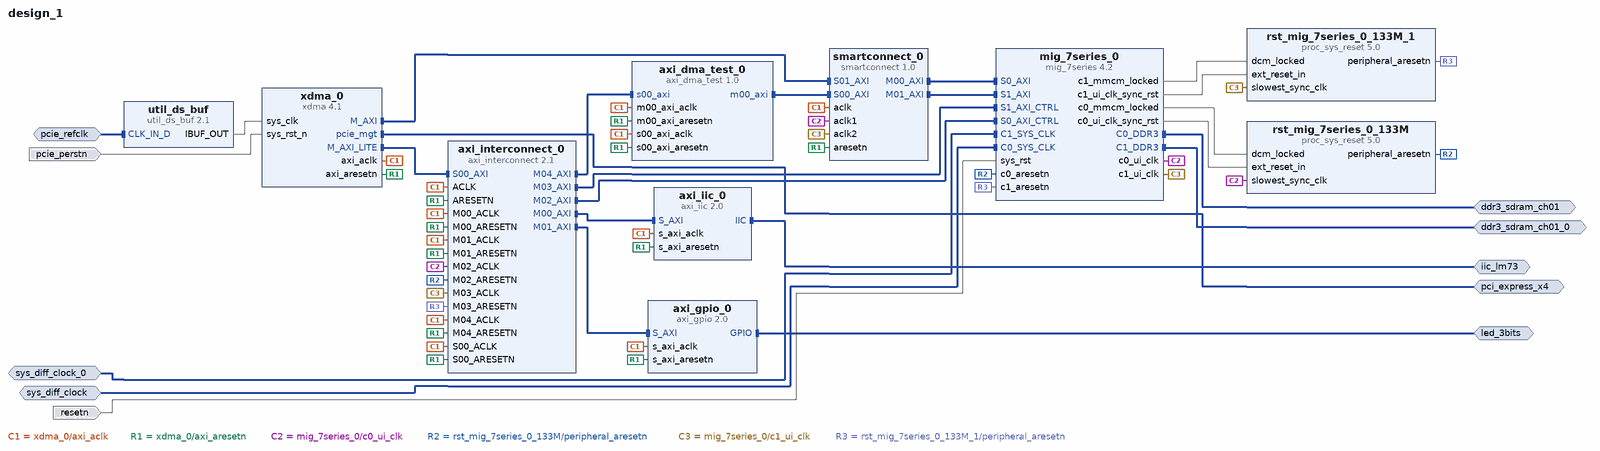
[diagram p0: block diagram of the top level]
# Vivado block design design_1, xc7k480tffg1156-2, Vivado 2020.1
create_bd_design design_1

create_bd_intf_port -mode Master -vlnv xilinx.com:interface:iic_rtl:1.0 iic_lm73
create_bd_intf_port -mode Slave -vlnv xilinx.com:interface:diff_clock_rtl:1.0 pcie_refclk
set_property -dict {CONFIG.FREQ_HZ 100000000} [get_bd_intf_ports pcie_refclk]
create_bd_intf_port -mode Master -vlnv xilinx.com:interface:gpio_rtl:1.0 led_3bits
create_bd_intf_port -mode Master -vlnv xilinx.com:interface:pcie_7x_mgt_rtl:1.0 pci_express_x4
create_bd_intf_port -mode Master -vlnv xilinx.com:interface:ddrx_rtl:1.0 ddr3_sdram_ch01
create_bd_intf_port -mode Slave -vlnv xilinx.com:interface:diff_clock_rtl:1.0 sys_diff_clock
set_property -dict {CONFIG.FREQ_HZ 100000000} [get_bd_intf_ports sys_diff_clock]
create_bd_intf_port -mode Master -vlnv xilinx.com:interface:ddrx_rtl:1.0 ddr3_sdram_ch01_0
create_bd_intf_port -mode Slave -vlnv xilinx.com:interface:diff_clock_rtl:1.0 sys_diff_clock_0
set_property -dict {CONFIG.FREQ_HZ 100000000} [get_bd_intf_ports sys_diff_clock_0]
create_bd_port -dir I -type rst pcie_perstn
set_property -dict {CONFIG.POLARITY ACTIVE_LOW} [get_bd_ports pcie_perstn]
create_bd_port -dir I -type rst resetn
set_property -dict {CONFIG.POLARITY ACTIVE_LOW} [get_bd_ports resetn]

create_bd_cell -type ip -vlnv xilinx.com:ip:xdma:4.1 xdma_0
set_property -dict [list \
  CONFIG.PCIE_BOARD_INTERFACE pci_express_x4 \
  CONFIG.PF0_DEVICE_ID_mqdma 9024 \
  CONFIG.PF2_DEVICE_ID_mqdma 9024 \
  CONFIG.PF3_DEVICE_ID_mqdma 9024 \
  CONFIG.SYS_RST_N_BOARD_INTERFACE pcie_perstn \
  CONFIG.axi_data_width 64_bit \
  CONFIG.axil_master_64bit_en false \
  CONFIG.axilite_master_en true \
  CONFIG.axilite_master_size 1 \
  CONFIG.axist_bypass_en false \
  CONFIG.axisten_freq 250 \
  CONFIG.cfg_mgmt_if false \
  CONFIG.mode_selection Advanced \
  CONFIG.pcie_id_if false \
  CONFIG.pciebar2axibar_axil_master 0x40000000 \
  CONFIG.pf0_base_class_menu Memory_controller \
  CONFIG.pf0_class_code_base 05 \
  CONFIG.pf0_class_code_interface 00 \
  CONFIG.pf0_class_code_sub 80 \
  CONFIG.pf0_device_id 7024 \
  CONFIG.pf0_sub_class_interface_menu Other_memory_controller \
  CONFIG.pl_link_cap_max_link_speed 5.0_GT/s \
  CONFIG.plltype QPLL1 \
  CONFIG.ref_clk_freq 100_MHz \
  CONFIG.xdma_axi_intf_mm AXI_Memory_Mapped \
  CONFIG.xdma_axilite_slave false \
  CONFIG.xdma_pcie_64bit_en true \
  CONFIG.xdma_rnum_chnl 2 \
  CONFIG.xdma_sts_ports false \
  CONFIG.xdma_wnum_chnl 2 \
] [get_bd_cells xdma_0]
create_bd_cell -type ip -vlnv xilinx.com:ip:axi_gpio:2.0 axi_gpio_0
set_property -dict [list \
  CONFIG.C_IS_DUAL 0 \
  CONFIG.GPIO2_BOARD_INTERFACE Custom \
  CONFIG.GPIO_BOARD_INTERFACE led_3bits \
  CONFIG.USE_BOARD_FLOW true \
] [get_bd_cells axi_gpio_0]
create_bd_cell -type ip -vlnv xilinx.com:ip:axi_iic:2.0 axi_iic_0
set_property -dict {CONFIG.IIC_BOARD_INTERFACE iic_lm73 CONFIG.USE_BOARD_FLOW true} [get_bd_cells axi_iic_0]
create_bd_cell -type ip -vlnv xilinx.com:ip:util_ds_buf:2.1 util_ds_buf
set_property -dict [list \
  CONFIG.C_BUF_TYPE IBUFDSGTE \
  CONFIG.DIFF_CLK_IN_BOARD_INTERFACE Custom \
  CONFIG.USE_BOARD_FLOW true \
] [get_bd_cells util_ds_buf]
create_bd_cell -type ip -vlnv xilinx.com:ip:smartconnect:1.0 smartconnect_0
set_property -dict {CONFIG.NUM_CLKS 3 CONFIG.NUM_MI 2 CONFIG.NUM_SI 2} [get_bd_cells smartconnect_0]
create_bd_cell -type ip -vlnv xilinx.com:ip:mig_7series:4.2 mig_7series_0
set_property -dict {CONFIG.BOARD_MIG_PARAM ddr3_sdram_ch01 CONFIG.RESET_BOARD_INTERFACE resetn} [get_bd_cells mig_7series_0]
create_bd_cell -type ip -vlnv xilinx.com:ip:proc_sys_reset:5.0 rst_mig_7series_0_133M
create_bd_cell -type ip -vlnv xilinx.com:ip:proc_sys_reset:5.0 rst_mig_7series_0_133M_1
create_bd_cell -type ip -vlnv xilinx.com:ip:axi_interconnect:2.1 axi_interconnect_0
set_property -dict {CONFIG.ENABLE_ADVANCED_OPTIONS 0 CONFIG.NUM_MI 5} [get_bd_cells axi_interconnect_0]
create_bd_cell -type ip -vlnv user.org:user:axi_dma_test:1.0 axi_dma_test_0

# ---- connections ----

connect_bd_intf_net -intf_net sys_diff_clock_0_1 [get_bd_intf_ports sys_diff_clock_0] [get_bd_intf_pins mig_7series_0/C1_SYS_CLK]
connect_bd_intf_net [get_bd_intf_pins mig_7series_0/S1_AXI_CTRL] [get_bd_intf_pins axi_interconnect_0/M03_AXI]
connect_bd_intf_net [get_bd_intf_pins xdma_0/M_AXI_LITE] [get_bd_intf_pins axi_interconnect_0/S00_AXI]
connect_bd_intf_net [get_bd_intf_ports iic_lm73] [get_bd_intf_pins axi_iic_0/IIC]
connect_bd_intf_net [get_bd_intf_ports sys_diff_clock] [get_bd_intf_pins mig_7series_0/C0_SYS_CLK]
connect_bd_intf_net [get_bd_intf_ports pcie_refclk] [get_bd_intf_pins util_ds_buf/CLK_IN_D]
connect_bd_intf_net [get_bd_intf_ports ddr3_sdram_ch01_0] [get_bd_intf_pins mig_7series_0/C1_DDR3]
connect_bd_intf_net [get_bd_intf_pins xdma_0/M_AXI] [get_bd_intf_pins smartconnect_0/S01_AXI]
connect_bd_intf_net [get_bd_intf_ports pci_express_x4] [get_bd_intf_pins xdma_0/pcie_mgt]
connect_bd_intf_net [get_bd_intf_pins mig_7series_0/S0_AXI_CTRL] [get_bd_intf_pins axi_interconnect_0/M02_AXI]
connect_bd_intf_net [get_bd_intf_pins smartconnect_0/S00_AXI] [get_bd_intf_pins axi_dma_test_0/m00_axi]
connect_bd_intf_net [get_bd_intf_pins axi_interconnect_0/M04_AXI] [get_bd_intf_pins axi_dma_test_0/s00_axi]
connect_bd_intf_net [get_bd_intf_ports led_3bits] [get_bd_intf_pins axi_gpio_0/GPIO]
connect_bd_intf_net [get_bd_intf_pins axi_interconnect_0/M00_AXI] [get_bd_intf_pins axi_iic_0/S_AXI]
connect_bd_intf_net [get_bd_intf_pins mig_7series_0/S0_AXI] [get_bd_intf_pins smartconnect_0/M00_AXI]
connect_bd_intf_net [get_bd_intf_pins axi_interconnect_0/M01_AXI] [get_bd_intf_pins axi_gpio_0/S_AXI]
connect_bd_intf_net [get_bd_intf_pins mig_7series_0/S1_AXI] [get_bd_intf_pins smartconnect_0/M01_AXI]
connect_bd_intf_net [get_bd_intf_ports ddr3_sdram_ch01] [get_bd_intf_pins mig_7series_0/C0_DDR3]
connect_bd_net [get_bd_pins xdma_0/axi_aclk] \
  [get_bd_pins axi_gpio_0/s_axi_aclk] [get_bd_pins axi_iic_0/s_axi_aclk] [get_bd_pins smartconnect_0/aclk] \
  [get_bd_pins axi_interconnect_0/M00_ACLK] [get_bd_pins axi_interconnect_0/M01_ACLK] \
  [get_bd_pins axi_interconnect_0/S00_ACLK] [get_bd_pins axi_interconnect_0/ACLK] [get_bd_pins axi_interconnect_0/M04_ACLK] \
  [get_bd_pins axi_dma_test_0/s00_axi_aclk] [get_bd_pins axi_dma_test_0/m00_axi_aclk]
connect_bd_net [get_bd_pins util_ds_buf/IBUF_OUT] [get_bd_pins xdma_0/sys_clk]
connect_bd_net -net rst_xdma_0_250M_peripheral_aresetn [get_bd_pins xdma_0/axi_aresetn] \
  [get_bd_pins smartconnect_0/aresetn] [get_bd_pins axi_iic_0/s_axi_aresetn] [get_bd_pins axi_gpio_0/s_axi_aresetn] \
  [get_bd_pins axi_interconnect_0/M00_ARESETN] [get_bd_pins axi_interconnect_0/M01_ARESETN] \
  [get_bd_pins axi_interconnect_0/S00_ARESETN] [get_bd_pins axi_interconnect_0/ARESETN] \
  [get_bd_pins axi_interconnect_0/M04_ARESETN] [get_bd_pins axi_dma_test_0/s00_axi_aresetn] \
  [get_bd_pins axi_dma_test_0/m00_axi_aresetn]
connect_bd_net [get_bd_ports pcie_perstn] [get_bd_pins xdma_0/sys_rst_n]
connect_bd_net [get_bd_pins mig_7series_0/c0_ui_clk] \
  [get_bd_pins smartconnect_0/aclk1] [get_bd_pins rst_mig_7series_0_133M/slowest_sync_clk] \
  [get_bd_pins axi_interconnect_0/M02_ACLK]
connect_bd_net [get_bd_pins mig_7series_0/c0_mmcm_locked] [get_bd_pins rst_mig_7series_0_133M/dcm_locked]
connect_bd_net [get_bd_pins mig_7series_0/c0_ui_clk_sync_rst] [get_bd_pins rst_mig_7series_0_133M/ext_reset_in]
connect_bd_net [get_bd_pins rst_mig_7series_0_133M/peripheral_aresetn] \
  [get_bd_pins mig_7series_0/c0_aresetn] [get_bd_pins axi_interconnect_0/M02_ARESETN]
connect_bd_net [get_bd_pins mig_7series_0/c1_ui_clk] \
  [get_bd_pins smartconnect_0/aclk2] [get_bd_pins rst_mig_7series_0_133M_1/slowest_sync_clk] \
  [get_bd_pins axi_interconnect_0/M03_ACLK]
connect_bd_net [get_bd_pins mig_7series_0/c1_mmcm_locked] [get_bd_pins rst_mig_7series_0_133M_1/dcm_locked]
connect_bd_net [get_bd_pins mig_7series_0/c1_ui_clk_sync_rst] [get_bd_pins rst_mig_7series_0_133M_1/ext_reset_in]
connect_bd_net [get_bd_pins rst_mig_7series_0_133M_1/peripheral_aresetn] \
  [get_bd_pins mig_7series_0/c1_aresetn] [get_bd_pins axi_interconnect_0/M03_ARESETN]
connect_bd_net [get_bd_ports resetn] [get_bd_pins mig_7series_0/sys_rst]

# ---- address map ----
assign_bd_address -offset 0x0000000000000000 -range 2G -target_address_space [get_bd_addr_spaces axi_dma_test_0/m00_axi] [get_bd_addr_segs mig_7series_0/c1_memmap/c1_memaddr]
assign_bd_address -offset 0x0000000080000000 -range 2G -target_address_space [get_bd_addr_spaces axi_dma_test_0/m00_axi] [get_bd_addr_segs mig_7series_0/c0_memmap/c0_memaddr]
assign_bd_address -offset 0x0000000000000000 -range 2G -target_address_space [get_bd_addr_spaces xdma_0/M_AXI] [get_bd_addr_segs mig_7series_0/c1_memmap/c1_memaddr]
assign_bd_address -offset 0x0000000080000000 -range 2G -target_address_space [get_bd_addr_spaces xdma_0/M_AXI] [get_bd_addr_segs mig_7series_0/c0_memmap/c0_memaddr]
exclude_bd_addr_seg -offset 0x0000000000000000 -range 1 -target_address_space [get_bd_addr_spaces xdma_0/M_AXI] [get_bd_addr_segs axi_gpio_0/S_AXI/Reg]
exclude_bd_addr_seg -offset 0x0000000000000000 -range 1 -target_address_space [get_bd_addr_spaces xdma_0/M_AXI] [get_bd_addr_segs axi_gpio_0/S_AXI/Reg]
exclude_bd_addr_seg -offset 0x0000000000000000 -range 1 -target_address_space [get_bd_addr_spaces xdma_0/M_AXI] [get_bd_addr_segs axi_iic_0/S_AXI/Reg]
exclude_bd_addr_seg -offset 0x0000000000000000 -range 1 -target_address_space [get_bd_addr_spaces xdma_0/M_AXI] [get_bd_addr_segs axi_iic_0/S_AXI/Reg]
exclude_bd_addr_seg -offset 0x0000000000000000 -range 1 -target_address_space [get_bd_addr_spaces xdma_0/M_AXI] [get_bd_addr_segs axi_iic_0/S_AXI/Reg]
exclude_bd_addr_seg -offset 0x0000000000000000 -range 1 -target_address_space [get_bd_addr_spaces xdma_0/M_AXI] [get_bd_addr_segs axi_iic_0/S_AXI/Reg]
exclude_bd_addr_seg -offset 0x0000000000000000 -range 1 -target_address_space [get_bd_addr_spaces xdma_0/M_AXI] [get_bd_addr_segs mig_7series_0/c0_s_axi_ctrl_memmap/c0_s_axi_ctrl_memaddr]
exclude_bd_addr_seg -offset 0x0000000000000000 -range 1 -target_address_space [get_bd_addr_spaces xdma_0/M_AXI] [get_bd_addr_segs mig_7series_0/c0_s_axi_ctrl_memmap/c0_s_axi_ctrl_memaddr]
exclude_bd_addr_seg -offset 0x0000000000000000 -range 1 -target_address_space [get_bd_addr_spaces xdma_0/M_AXI] [get_bd_addr_segs mig_7series_0/c1_s_axi_ctrl_memmap/c1_s_axi_ctrl_memaddr]
exclude_bd_addr_seg -offset 0x0000000000000000 -range 1 -target_address_space [get_bd_addr_spaces xdma_0/M_AXI] [get_bd_addr_segs mig_7series_0/c1_s_axi_ctrl_memmap/c1_s_axi_ctrl_memaddr]
exclude_bd_addr_seg -offset 0x000000007F010000 -range 64K -target_address_space [get_bd_addr_spaces xdma_0/M_AXI] [get_bd_addr_segs axi_iic_0/S_AXI/Reg]
exclude_bd_addr_seg -offset 0x000000007F100000 -range 1M -target_address_space [get_bd_addr_spaces xdma_0/M_AXI] [get_bd_addr_segs mig_7series_0/c0_s_axi_ctrl_memmap/c0_s_axi_ctrl_memaddr]
exclude_bd_addr_seg -offset 0x000000007F200000 -range 1M -target_address_space [get_bd_addr_spaces xdma_0/M_AXI] [get_bd_addr_segs mig_7series_0/c1_s_axi_ctrl_memmap/c1_s_axi_ctrl_memaddr]
assign_bd_address -offset 0x40000000 -range 64K -target_address_space [get_bd_addr_spaces xdma_0/M_AXI_LITE] [get_bd_addr_segs axi_gpio_0/S_AXI/Reg]
assign_bd_address -offset 0x40010000 -range 64K -target_address_space [get_bd_addr_spaces xdma_0/M_AXI_LITE] [get_bd_addr_segs axi_iic_0/S_AXI/Reg]
assign_bd_address -offset 0x40020000 -range 64K -target_address_space [get_bd_addr_spaces xdma_0/M_AXI_LITE] [get_bd_addr_segs mig_7series_0/c0_s_axi_ctrl_memmap/c0_s_axi_ctrl_memaddr]
assign_bd_address -offset 0x40030000 -range 64K -target_address_space [get_bd_addr_spaces xdma_0/M_AXI_LITE] [get_bd_addr_segs mig_7series_0/c1_s_axi_ctrl_memmap/c1_s_axi_ctrl_memaddr]
assign_bd_address -offset 0x40040000 -range 64K -target_address_space [get_bd_addr_spaces xdma_0/M_AXI_LITE] [get_bd_addr_segs axi_dma_test_0/s00_axi/reg0]
exclude_bd_addr_seg -offset 0x00000000 -range 1 -target_address_space [get_bd_addr_spaces xdma_0/M_AXI_LITE] [get_bd_addr_segs mig_7series_0/c0_memmap/c0_memaddr]
exclude_bd_addr_seg -offset 0x00000000 -range 1G -target_address_space [get_bd_addr_spaces xdma_0/M_AXI_LITE] [get_bd_addr_segs mig_7series_0/c1_memmap/c1_memaddr]
exclude_bd_addr_seg -offset 0x00000000 -range 1 -target_address_space [get_bd_addr_spaces xdma_0/M_AXI_LITE] [get_bd_addr_segs mig_7series_0/c1_memmap/c1_memaddr]
exclude_bd_addr_seg -offset 0x80000000 -range 2G -target_address_space [get_bd_addr_spaces xdma_0/M_AXI_LITE] [get_bd_addr_segs mig_7series_0/c0_memmap/c0_memaddr]

validate_bd_design
save_bd_design
